# EAGLE schematic LCD16x02_ENCODER_ESP32_CIRCUIT (EAGLE 9.6.2)
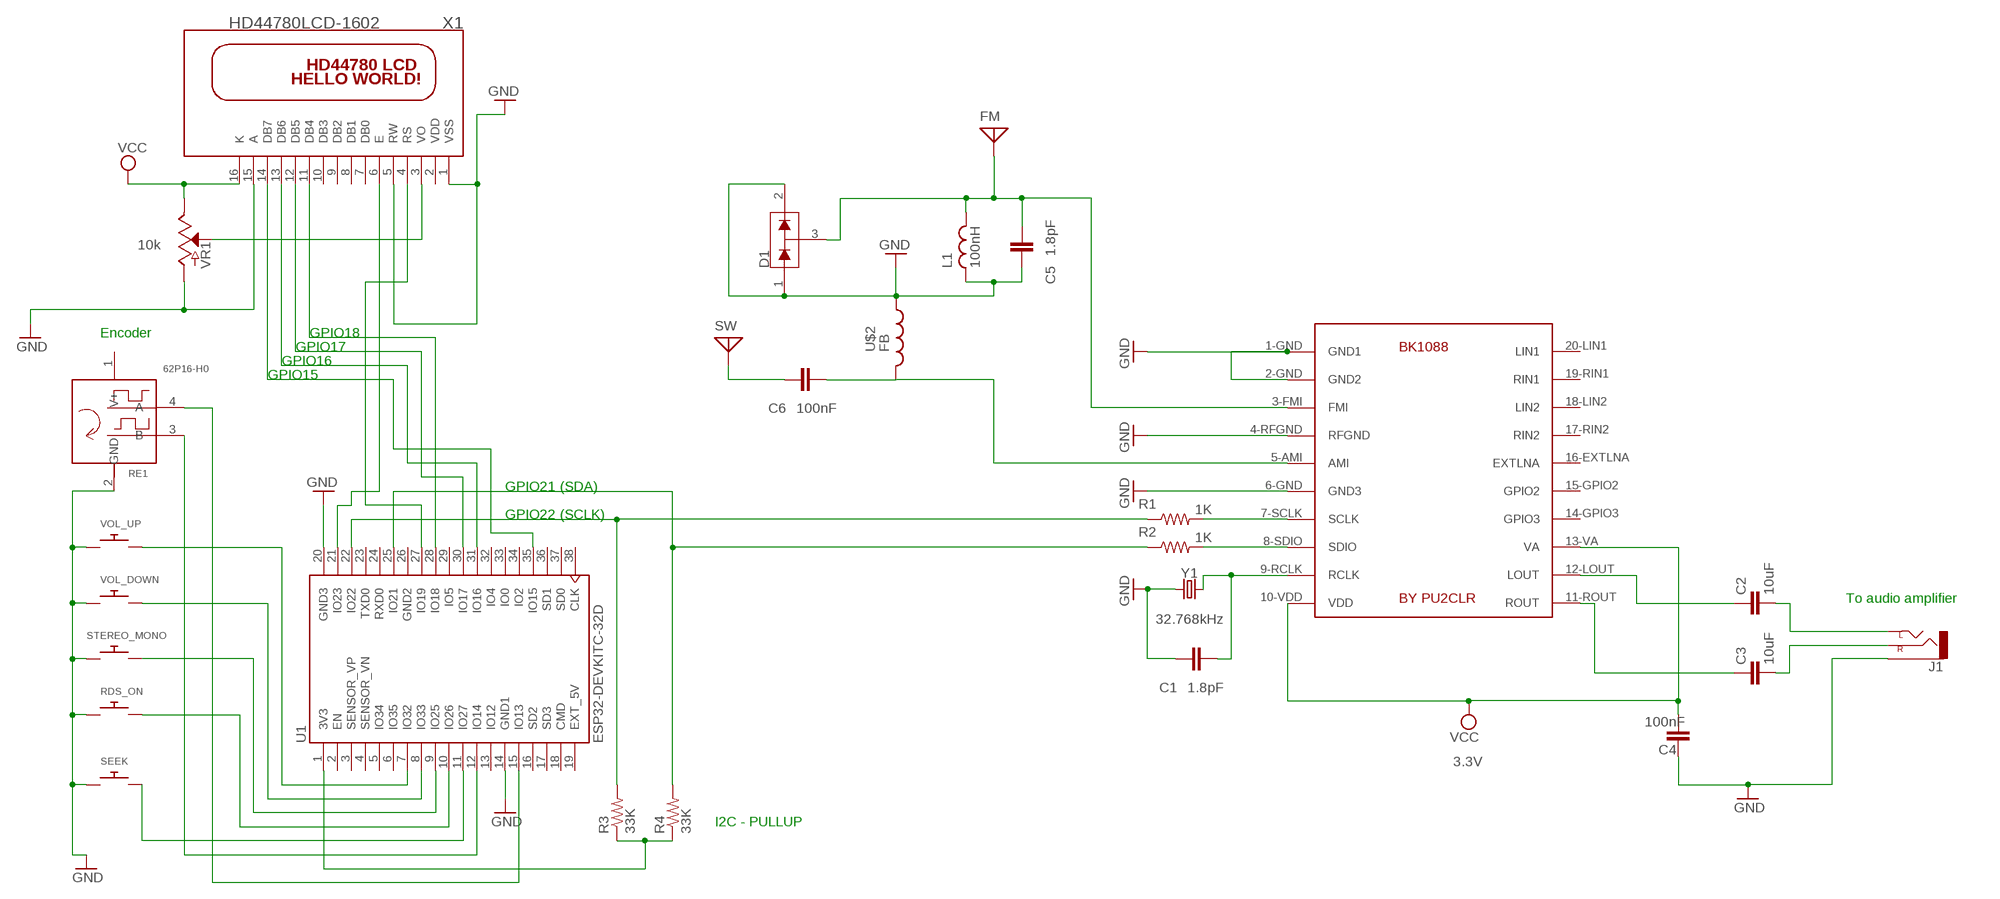
[diagram p0: schematic, sheet 1]

## Parts
C1  1.8pF  C5/3  [C5B3]
C2  10uF  10UF-0603-6.3V-20%  [0603]
C3  10uF  10UF-0603-6.3V-20%  [0603]
C4  100nF  C5/3  [C5B3]
C5  1.8pF  C5/3  [C5B3]
C6  100nF  C5/3  [C5B3]
D1  200mA/70V  BAV99  [SOT23-3]
FM  ANTENNA  [PAD-01]
J1  AUDIO_JACK_2.5MMSPECIAL_POGO_PINS  [STEREOJACK2.5MM_SPECIAL_POGOPINS]
L1  100nH  L  (no package)
R1  1K  R-US_AXIAL-7.2MM-PITCH  [RESAD724W46L381D178B]
R2  1K  R-US_AXIAL-7.2MM-PITCH  [RESAD724W46L381D178B]
R3  33K  R-US_0204/2V  [0204V]
R4  33K  R-US_0204/2V  [0204V]
RDS_ON  SWITCH_PUSHBUTTONC&K_KSS  [BTN_CK_KSS]
RE1  62P16-H0  [62P]
SEEK  SWITCH_PUSHBUTTONC&K_KSS  [BTN_CK_KSS]
STEREO_MONO  SWITCH_PUSHBUTTONC&K_KSS  [BTN_CK_KSS]
SW  ANTENNA  [PAD-01]
U1  ESP32-DEVKITC-32D  [MODULE_ESP32-DEVKITC-32D]
U$1  BK1088BK1088  [SOIC127P1032X265-20N]
U$2  FB  [FB]
VOL_DOWN  SWITCH_PUSHBUTTONC&K_KSS  [BTN_CK_KSS]
VOL_UP  SWITCH_PUSHBUTTONC&K_KSS  [BTN_CK_KSS]
VR1  10k  POTENTIOMETER-PTH-9MM-1/20W-20%  [POT-PTH-ALPS]
X1  HD44780LCD-1602  [LCD1602]
Y1  32.768kHz  CRYSTAL-32.768KHZPTH-2X6  [CRYSTAL-PTH-2X6-CYL]

## Nets
GND: C1.1 C4.2 C5.1 D1.1(A1) D1.2(C2) J1.RING1(SLEEVE) L1.1 RDS_ON.P$1 RE1.2(GND) SEEK.P$1 STEREO_MONO.P$1 U1.14(GND1) U1.20(GND3) U$1.1-GND(GND1) U$1.2-GND(GND2) U$1.4-RFGND(RFGND) U$1.6-GND(GND3) U$2.P$1 VOL_DOWN.P$1 VOL_UP.P$1 VR1.P$3(A) X1.15(A) Y1.1
N$1: R1.2 U$1.7-SCLK(SCLK)
N$2: R2.2 U$1.8-SDIO(SDIO)
N$4: R2.1 R4.2 U1.25(IO21)
N$5: R1.1 R3.2 U1.22(IO22)
N$7: C1.2 U$1.9-RCLK(RCLK) Y1.2
N$8: C3.1 U$1.11-ROUT(ROUT)
N$9: C2.1 U$1.12-LOUT(LOUT)
N$10: STEREO_MONO.P$2 U1.9(IO25)
N$11: C3.2 J1.TIP(RIGHT)
N$12: C2.2 J1.SHIELD(LEFT)
N$13: C6.2 U$1.5-AMI(AMI) U$2.P$2
N$14: VR1.P$2(S) X1.3(VO)
N$15: U1.28(IO18) X1.11(DB4)
N$16: SEEK.P$2 U1.11(IO27)
N$17: U1.30(IO17) X1.12(DB5)
N$18: U1.31(IO16) X1.13(DB6)
N$19: U1.35(IO15) X1.14(DB7)
N$20: U1.7(IO32) VOL_UP.P$2
N$21: RDS_ON.P$2 U1.10(IO26)
N$22: U1.8(IO33) VOL_DOWN.P$2
N$23: U1.27(IO19) X1.4(RS)
N$24: U1.21(IO23) X1.6(E)
N$25: R3.1 R4.1 U1.1(3V3)
N$26: RE1.3(B) U1.12(IO14)
N$27: RE1.4(A) U1.15(IO13)
N$28: C5.2 D1.3(COM) FM.1 L1.2 U$1.3-FMI(FMI)
N$29: C6.1 SW.1
VCC: C4.1 U$1.10-VDD(VDD) U$1.13-VA(VA) VR1.P$1(E) X1.16(K)
VSS: X1.1(VSS) X1.5(RW) ; supply symbol labelled GND
Unconnected: RE1.1(V+) U1.2(EN) U1.3(SENSOR_VP) U1.4(SENSOR_VN) U1.5(IO34) U1.6(IO35) U1.13(IO12) U1.16(SD2) U1.17(SD3) U1.18(CMD) U1.23(TXD0) U1.24(RXD0) U1.29(IO5) U1.32(IO4) U1.33(IO0) U1.34(IO2) U1.36(SD1) U1.37(SD0) U1.38(CLK) U$1.14-GPIO3(GPIO3) U$1.15-GPIO2(GPIO2) U$1.16-EXTLNA(EXTLNA) U$1.17-RIN2(RIN2) U$1.18-LIN2(LIN2) U$1.19-RIN1(RIN1) U$1.20-LIN1(LIN1) X1.2(VDD) X1.7(DB0) X1.8(DB1) X1.9(DB2) X1.10(DB3)

## Notes on the sheet
- Encoder | GPIO18
- GPIO17
- GPIO16
- GPIO15
- GPIO21 (SDA)
- GPIO22 (SCLK)
- To audio amplifier
- I2C - PULLUP

## Power pins joined to a net without a drawn wire
EXT_5V: U1.19(EXT_5V)
GND2: U1.26(GND2)

## Library data of the parts
C1 C4-C6 = capacitor-wima:C: CAPACITOR naming: grid - package width
C2 C3 = SparkFun-Capacitors:10UF: 10.0µF ceramic capacitors A capacitor is a passive two-terminal electrical component used to store electrical energy temporarily in an electric field.; PROD_ID: CAP-11015
D1 = SparkFun-DiscreteSemi:BAV99: Series-pair diode array Two small signal silicon diodes connected anode to cathode. Connections to all three nodes available. Link to datasheet <https://www.fairchildsemi.com/datasheets/BA/BAV99.pdf> SparkFun Products: SparkFun AutoDriver <https://www.sparkfun.com/products/13752>; PROD_ID: DIO-10647
FM SW = discrete:ANTENNA: Antenna
J1 = SparkFun-Connectors:AUDIO_JACK_2.5MM: Audio Jack 2.5mm variants of PTH and SMT audio jacks. SparkFun Products: SparkFun PicoBoard <https://www.sparkfun.com/products/11888>- 2.5mm SMD
L1 = ngspice-simulation:L: INDUCTOR
R1 R2 = Resistor:R-US: Resistor Fixed - ANSI; CATEGORY: Resistor; SUB-CATEGORY: Fixed
R3 R4 = adafruit:R-US_: RESISTOR, American symbol
RDS_ON SEEK STEREO_MONO VOL_DOWN VOL_UP = adafruit:SWITCH_PUSHBUTTON: Buttons SOFTTOUCHSMD_SJ - Soft touch temporary push button (Super Junk Akihabara) Compatible with SKPMANE010 [Mouser: 688-SKPMAN] C&K_KSS = Digikey: KSS221GLFS
RE1 = rotary-encoder:62P*0
U1 = ESP32-DEVKITC-32D:ESP32-DEVKITC-32D: Eval Board For Esp-Wroom-32 Check prices <https://pricing.snapeda.com/parts/ESP32-DEVKITC-32D/Espressif%20Systems/view-part?ref=eda>; AVAILABILITY: Warning; DESCRIPTION: WiFi Development Tools (802.11) ESP32 General Development Kit, ESP32-WROOM-32D on the board; MF: Espressif Systems; MP: ESP32-DEVKITC-32D; PACKAGE: None; PRICE: None; PURCHASE-URL: https://pricing.snapeda.com/search/part/ESP32-DEVKITC-32D/?ref=eda
U$1 = BK1088:BK1088: BK1088
U$2 = adafruit:FB: Ferrite bead Digikey #P9821BK-ND
VR1 = SparkFun-Resistors:POTENTIOMETER: Potentiometer (Pot) Three-terminal potentiometers, with an adjustable wiper and two adjustable resistors. A pot can be used to create a configurable voltage divider, or as a variable resistor. Variants ALPS_POT and ALPS_POT_KIT - PTH, breadboard compatible, 9mm square pots Rotary Potentiometer - Linear (10k ohm) <https://www.sparkfun.com/products/9288> (COM-09288) The KIT variant exposes copper on only one side of the PTH pad, so the part can only be assembled on one side of the PCB. Useful for beginner soldering kits.; PROD_ID: RES-09177; SF_SKU: COM-09288
X1 = adafruit:HD44780LCD: HD44780 LCD Standard character type LCDs, available in sizes from 8x1 to 40x4!
Y1 = SparkFun-Clocks:CRYSTAL-32.768KHZ: 32.768kHz Crystal Frequency: 32.768kHz Frequency Stability: ±20ppm Load Capacitance: 12.5pF (PTH-2X6 & SMD-3.2X1.5), 6pF (SMD-2X6) SparkFun Products: SparkFun BigTime Watch Kit <https://www.sparkfun.com/products/11734> SparkFun nRF52832 Breakout <https://www.sparkfun.com/products/13990> SparkFun Real Time Clock Module <https://www.sparkfun.com/products/12708>; PROD_ID: XTAL-10112